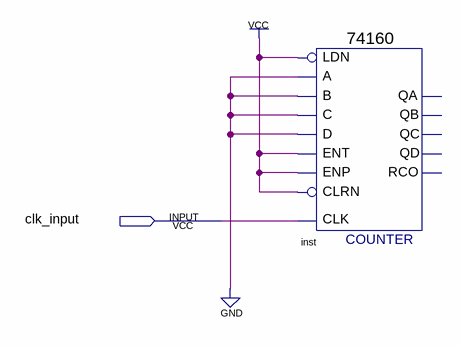
[diagram p0: schematic sheet]
// Quartus schematic main.bdf as structural Verilog: 1 symbols, 1 pins
module main (
  input  clk_input
);

  \74160  inst (
    .CLK(clk_input), .ENT(1'b1), .A(1'b0), .B(1'b0), .C(1'b0), .D(1'b0), .LDN(1'b1), .ENP(1'b1), .CLRN(1'b1));  // open: QD, QA, QB, QC, RCO
endmodule
